# Altium schematic sheet RS485.SchDoc: RP2040 CNC
size B; Author: AM; CompanyName: Expatria Technologies; DrawnBy: A.Marles; Engineer: AM; Organization: Expatria Technolgoies; DocumentNumber: 6; SheetNumber: 6; SheetTotal: 14
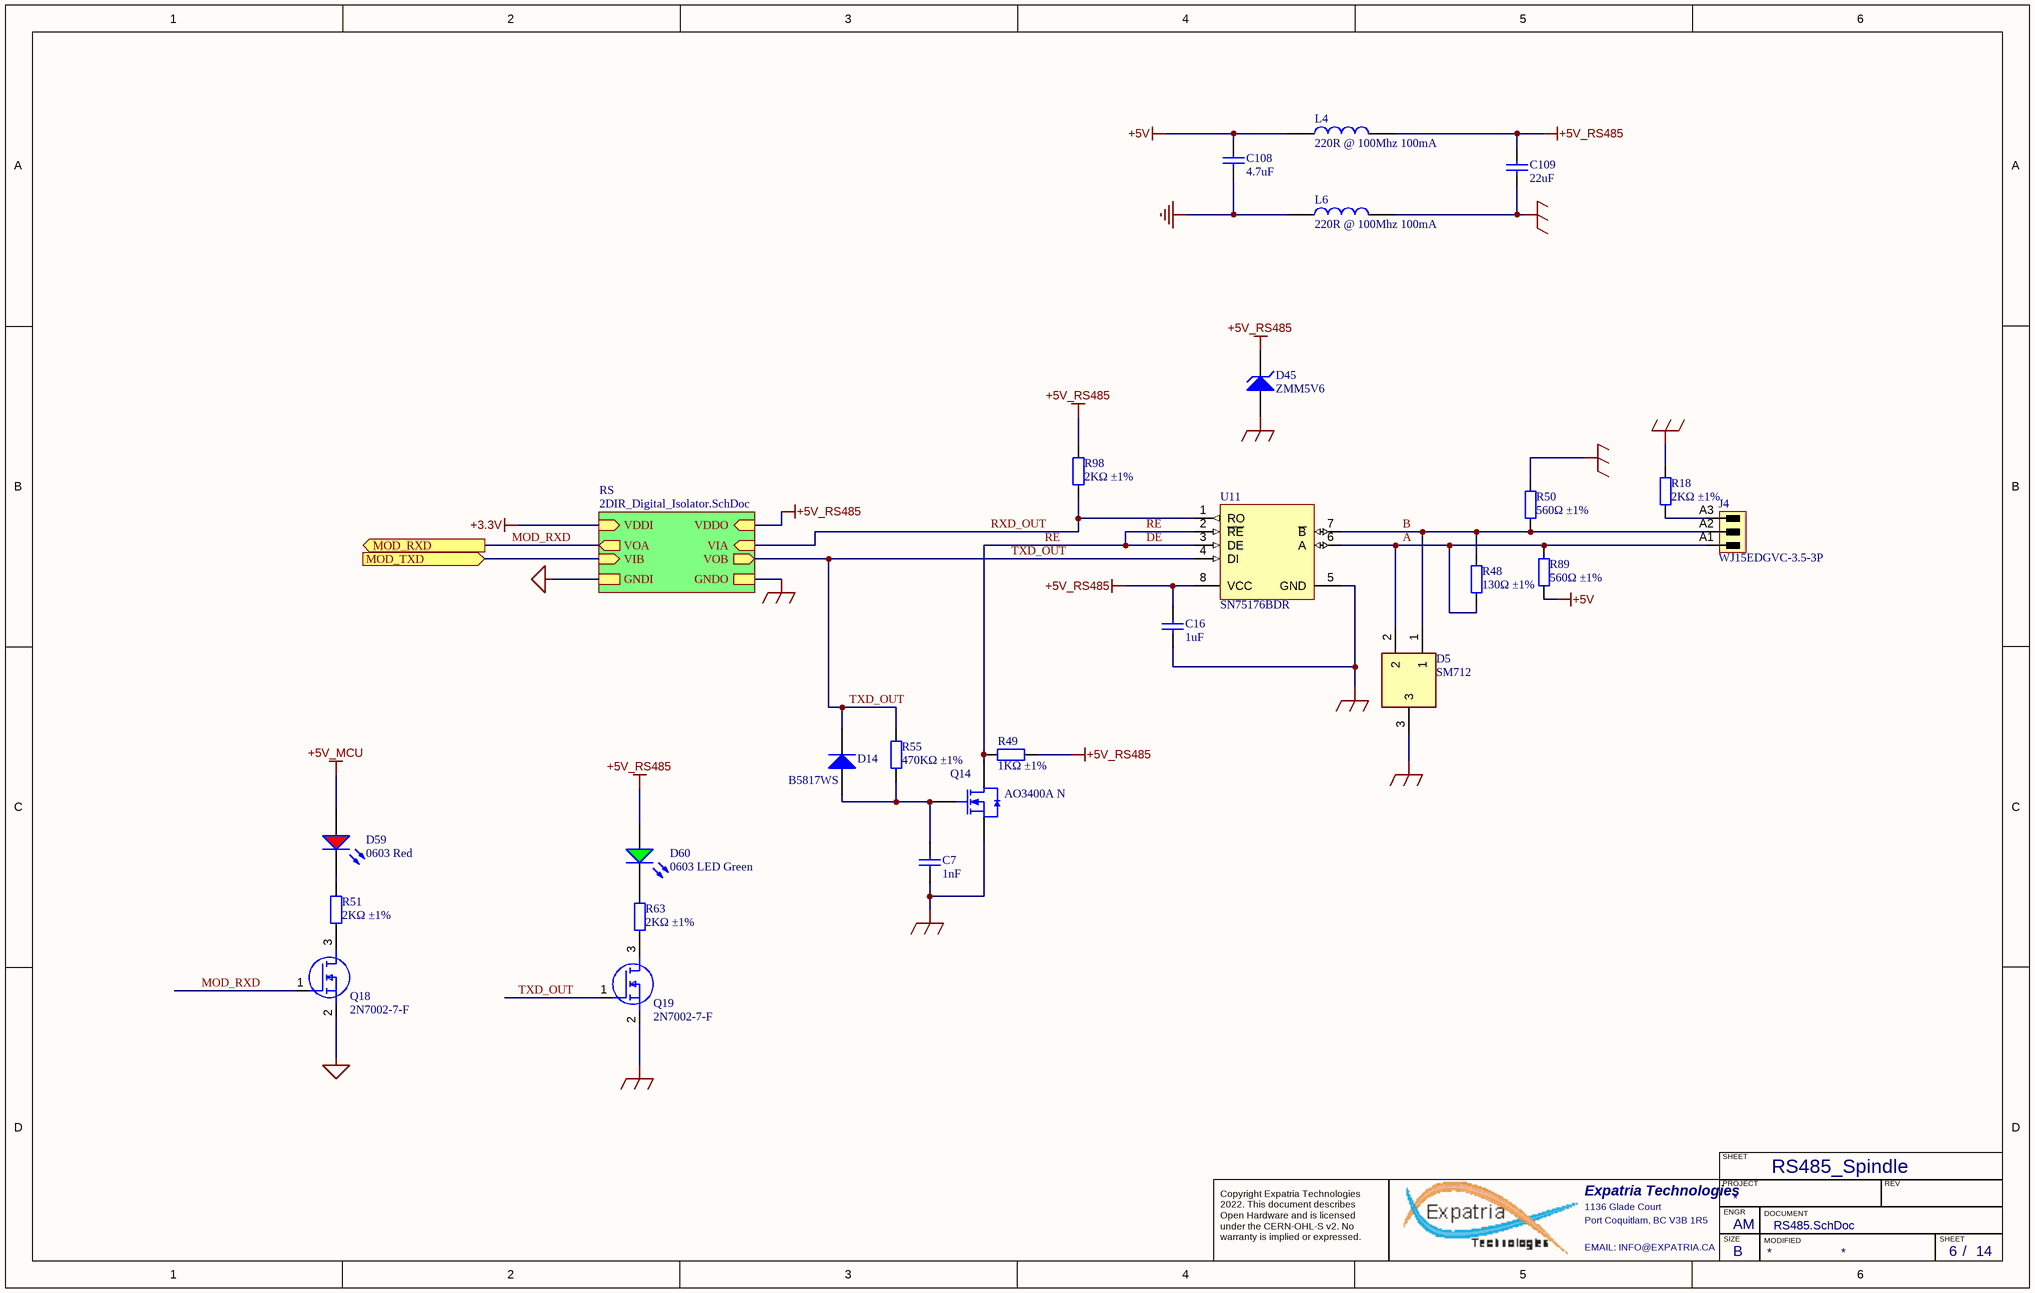
[diagram p0: RS485.SchDoc]

## Parts
C7  1nF  [0603_C]
C16  1uF  [0603_C]
C108  4.7uF  [0805_C]
C109  22uF  [0805_C]
D5  SM712  [SOT95P230X117-3N]
D14  B5817WS  [SOD-323]
D45  ZMM5V6  [LL-34]
D59  0603 Red  [0603_LED_S1]
D60  0603 LED Green  [0603_LED_S1]
J4  WJ15EDGVC-3.5-3P  [691321100003 - 3.5mm  3p]
L4  220R @ 100Mhz 100mA  [0402_L]
L6  220R @ 100Mhz 100mA  [0402_L]
Q14  AO3400A N  [SOT-23-3L]
Q18  2N7002-7-F  [SOT-23(SOT-23-3)]
Q19  2N7002-7-F  [SOT-23(SOT-23-3)]
R18  2KΩ ±1%  [0603_R]
R48  130Ω ±1%  [0603_R]
R49  1KΩ ±1%  [0603_R]
R50  560Ω ±1%  [0603_R]
R51  2KΩ ±1%  [0402_R]
R55  470KΩ ±1%  [0603_R]
R63  2KΩ ±1%  [0402_R]
R89  560Ω ±1%  [0603_R]
R98  2KΩ ±1%  [0603_R]
U11  SN75176BDR  [SOIC-8_150mil]

## Sub-sheets
RS = 2DIR_Digital_Isolator.SchDoc: VDDO (in), VIB (in), VIA (in), VOB (out), VOA (out), VDDI (in), GNDO, GNDI

## Ports
MOD_RXD (out), MOD_TXD (in)

## Nets
+3.3V: sheet RS/VDDI
+5V: C108.2 L4.1 R89.2
+5V_MCU: D59.A
+5V_RS485: C16.2 C109.2 D45.2(K) D60.A L4.2 R49.1 R98.2 U11.8(VCC) ; sheet RS/VDDO
GND: C108.1 L6.1
MCU_GND: Q18.2(S) ; sheet RS/GNDI
MOD_GND: C7.2 C16.1 C109.1 D5.3 D45.1(A) L6.2 Q14.2(S) Q19.2(S) R18.1 R50.1 U11.5(GND) ; sheet RS/GNDO
A: D5.2 J4.A1 R48.1 R89.1 U11.6(A)
B: D5.1 J4.A2 R48.2 R50.2 U11.7(~{B})
DE: Q14.3(D) R49.2 U11.2(~{RE}) U11.3(DE)  [also labelled RE]
MOD_RXD: Q18.1(G) ; port MOD_RXD, sheet RS/VOA
MOD_TXD: port MOD_TXD, sheet RS/VIB
RXD_OUT: R98.1 U11.1(RO) ; sheet RS/VIA
TXD_OUT: D14.2(K) Q19.1(G) R55.1 U11.4(DI) ; sheet RS/VOB
NetC7_1: C7.1 D14.1(A) Q14.1(G) R55.2
NetD59_K: D59.K R51.2
NetD60_K: D60.K R63.2
NetJ4_A3: J4.A3 R18.2
NetQ18_3: Q18.3(D) R51.1
NetQ19_3: Q19.3(D) R63.1

## Notes on the sheet
- RS485_Spindle
- SHEET
- Expatria Technologies
- 1136 Glade Court
- Port Coquitlam, BC V3B 1R5
- PROJECT
- SIZE
- ENGR
- MODIFIED
- DOCUMENT
- REV
- Copyright Expatria Technologies 2022. This document describes Open Hardware and is licensed under the CERN-OHL-S v2. No warranty is implied or expressed.
- EMAIL: INFO@EXPATRIA.CA
- B
- /

## Library data of the parts
C7 = 0603 1nF (102) 10% 50V: Chip capacitors; Manufacturer: Samsung Electro-Mechanics; PartNumber: CL10B102KB8NNNC; Tolerance: 10%; Voltage: 50V; ComponentLink1Description: Supplier link; ComponentLink1URL: http://www.szlcsc.com/product/details_1940.html; Package: 0603; Supplier: LC; SuppliersPartNumber: C1588; Capacitance: 1nF
C16 = 0603 1uF (105) 10% 50V: Chip capacitors; Manufacturer: Samsung Electro-Mechanics; PartNumber: CL10A105KB8NNNC; Tolerance: 10%; Voltage: 50V; ComponentLink1Description: Supplier link; ComponentLink1URL: http://www.szlcsc.com/product/details_16531.html; Package: 0603; Supplier: LC; SuppliersPartNumber: C15849; Capacitance: 1uF
C108 = 0805 4.7uF (475) 10% 25V: Chip capacitors; Manufacturer: Samsung Electro-Mechanics; PartNumber: CL21A475KAQNNNE; Tolerance: 10%; Voltage: 25V; ComponentLink1Description: Supplier link; ComponentLink1URL: http://www.szlcsc.com/product/details_2131.html; Package: 0805; Supplier: LC; SuppliersPartNumber: C1779; Capacitance: 4.7uF
C109 = 0805 22uF (226) 20% 25V: Chip capacitors; Manufacturer: Samsung Electro-Mechanics; PartNumber: CL21A226MAQNNNE; Tolerance: 20%; Voltage: 25V; ComponentLink1Description: Supplier link; ComponentLink1URL: http://www.szlcsc.com/product/details_46786.html; Package: 0805; Supplier: LC; SuppliersPartNumber: C45783; Capacitance: 22uF
D5 = CDSOT23-SM712: Bidirectional 12V (Max), 7V (Max) 7.5V / 13.3V 10V / 20V 12A(8/20us) SOT-23-3 TVS RoHS; Manufacturer_Name: DOWO; Height: 1.17mm; Manufacturer_Part_Number: SM712; SuppliersPartNumber: C293966
D14 = SOD-123 B5819W  SL: 20V 750mV@3A 1A SOD-323 Schottky Barrier Diodes (SBD) ROHS; Package: SOD-323; Supplier: LC; SuppliersPartNumber: C699102
D45 = LL-34 ZMM5V6: 500mW - 0.1uA @ 1V 5.6V LL-34 Zener Diodes ROHS; ComponentLink1Description: 供应商链接; ComponentLink1URL: http://www.szlcsc.com/product/details_8541.html; Package: LL-34; Supplier: LC; SuppliersPartNumber: C8062
D59 = 19-213SURC/S530-A3/TR8: 20mA 632nm Colorless transparence 624nm~624nm -40℃~+85℃ Red 120° 60mW 0603 Light Emitting Diodes (LED) ROHS; Manufacturer: Everlight Elec; ComponentLink1Description: 供应商链接; ComponentLink1URL: http://www.szlcsc.com/product/details_2659.html; Package: 0603; Supplier: LC; SuppliersPartNumber: C72039; Color: Red; Supplier 1: LC; Supplier Part Number 1: C72039; Manufacturer Part Number: 19-213SURC/S530-A3/TR8
D60 = 19-217/GHC-YR1S2/3T: Colorless transparence -40℃~+85℃ 520nm~535nm Emerald 120° 110mW 0603 Light Emitting Diodes (LED) ROHS; Manufacturer: Everlight Elec; Package: 0603; Supplier: LC; SuppliersPartNumber: C72043; Color: Green; Manufacturer Part Number: 19-217/GHC-YR1S2/3T
J4 = 3.5mm Terminal Header 3p: Header,Male Pin,Covered(4 Sided) 3 1 0.138"（3.50mm） 3 P=3.5mm Pluggable System Terminal Block RoHS; Manufacturer: Ningbo Kangnex Elec; Pitch_mm: 3.5 mm; UL_94_flammability_rating: V-0; Side_termination_characteristic: closed side; Solder_pin_length_mm: 3.2 mm; Short_text_for_material: SL 3.50/03/180G 3.2SN OR BX; Pitch_inch: 0.138 inch; PartNumber: WJ15EDGVC-3.5-3P; PackageReference: SL_3_50_180G_03; ComponentLink1URL: http://www.weidmueller.com/; ComponentLink1Description: Manufacturer URL; Packaging: Box; Revision: V1; SuppliersPartNumber: C192778; Manufacturer 1: Ningbo Kangnex Elec; Manufacturer Part Number 1: WJ15EDGVC-3.5-3P; Package: P=3.5mm
L4 L6 = 0402 220R@100Mhz 0.1A: Ferrite Bead; Notepad: *; Package: 0402; Supplier: LC; SuppliersPartNumber: C92617
Q14 = AO3400A N道沟 X0YV1T SOT-23: MOS(场效应管); ComponentLink1Description: 供应商链接; ComponentLink1URL: http://www.szlcsc.com/product/details_21629.html; Package: SOT-23; Supplier: LC; SuppliersPartNumber: C20917
Q18 Q19 = 2N7002-7-F: 60V 115mA 7.5Ω@5V,50mA 370mW N Channel SOT-23 MOSFETs ROHS; Manufacturer: Diodes Inc.; SuppliersPartNumber: C85049; Manufacturer Part Number: 2N7002-7-F; Value: 2N7002-7-F; Datasheet Link: https://datasheet.datasheetarchive.com/originals/distributors/SFDatasheet-0/sf-0003625.pdf; Height: 1.2mm; Manufacturer_Part_Number: 2N7002-7-F; Mouser Part Number: 621-2N7002-F; Mouser Price/Stock: https://www.mouser.co.uk/ProductDetail/Diodes-Incorporated/2N7002-7-F?qs=jMXWnm70%252BC%252BAX%252BMLzUkTZg%3D%3D; Arrow Part Number: 2N7002-7-F; Arrow Price/Stock: https://www.arrow.com/en/products/2n7002-7-f/diodes-incorporated?region=nac
R18 R98 = 0603 2K (2001) 1%: Chip resistor; Manufacturer: Uniroyal Elec; PartNumber: 0603WAF2001T5E; Power: 1/10W; ComponentLink1Description: Supplier link; ComponentLink1URL: http://www.szlcsc.com/product/details_23702.html; Package: 0603; Supplier: LC; SuppliersPartNumber: C22975; Resistance: 2KΩ; Tolerance: 1%
R48 = 0603 130R (1300) 1%: Chip resistor; Manufacturer: Uniroyal Elec; PartNumber: 0603WAF1300T5E; Power: 1/10W; ComponentLink1Description: Supplier link; ComponentLink1URL: http://www.szlcsc.com/product/details_23523.html; Package: 0603; Supplier: LC; SuppliersPartNumber: C22796; Resistance: 130Ω; Tolerance: 1%
R49 = 0603 1K (1001) 1%: Chip resistor; Manufacturer: Uniroyal Elec; PartNumber: 0603WAF1001T5E; Power: 1/10W; ComponentLink1Description: Supplier link; ComponentLink1URL: http://www.szlcsc.com/product/details_21904.html; Package: 0603; Supplier: LC; SuppliersPartNumber: C21190; Resistance: 1KΩ; Tolerance: 1%
R50 R89 = 0603 560R (5600) 1%: Chip resistor; Manufacturer: Uniroyal Elec; PartNumber: 0603WAF5600T5E; Power: 1/10W; ComponentLink1Description: Supplier link; ComponentLink1URL: http://www.szlcsc.com/product/details_23931.html; Package: 0603; Supplier: LC; SuppliersPartNumber: C23204; Resistance: 560Ω; Tolerance: 1%
R51 R63 = 0402 2K (2001) 1%: Chip resistor; Manufacturer: Uniroyal Elec; Manufacturer Part Number: 0402WGF2001TCE; Power: 1/16W; ComponentLink1Description: Supplier link; ComponentLink1URL: http://www.szlcsc.com/product/details_4516.html; Package: 0402; Supplier: LC; SuppliersPartNumber: C4109; Resistance: 2KΩ; Tolerance: 1%
R55 = 0603 470K (4703) 1%: Chip resistor; Manufacturer: Uniroyal Elec; PartNumber: 0603WAF4703T5E; Power: 1/10W; ComponentLink1Description: Supplier link; ComponentLink1URL: http://www.szlcsc.com/product/details_23905.html; Package: 0603; Supplier: LC; SuppliersPartNumber: C23178; Resistance: 470KΩ; Tolerance: 1%
U11 = SN75176BDR_[C7063]: RS-485/RS-422; ComponentLink1Description: 供应商链接; ComponentLink1URL: http://www.szlcsc.com/product/details_7535.html; Package: SOIC-8_150mil; Supplier: LC; SuppliersPartNumber: C7063